# EAGLE design vreg (EAGLE 7.5.0)
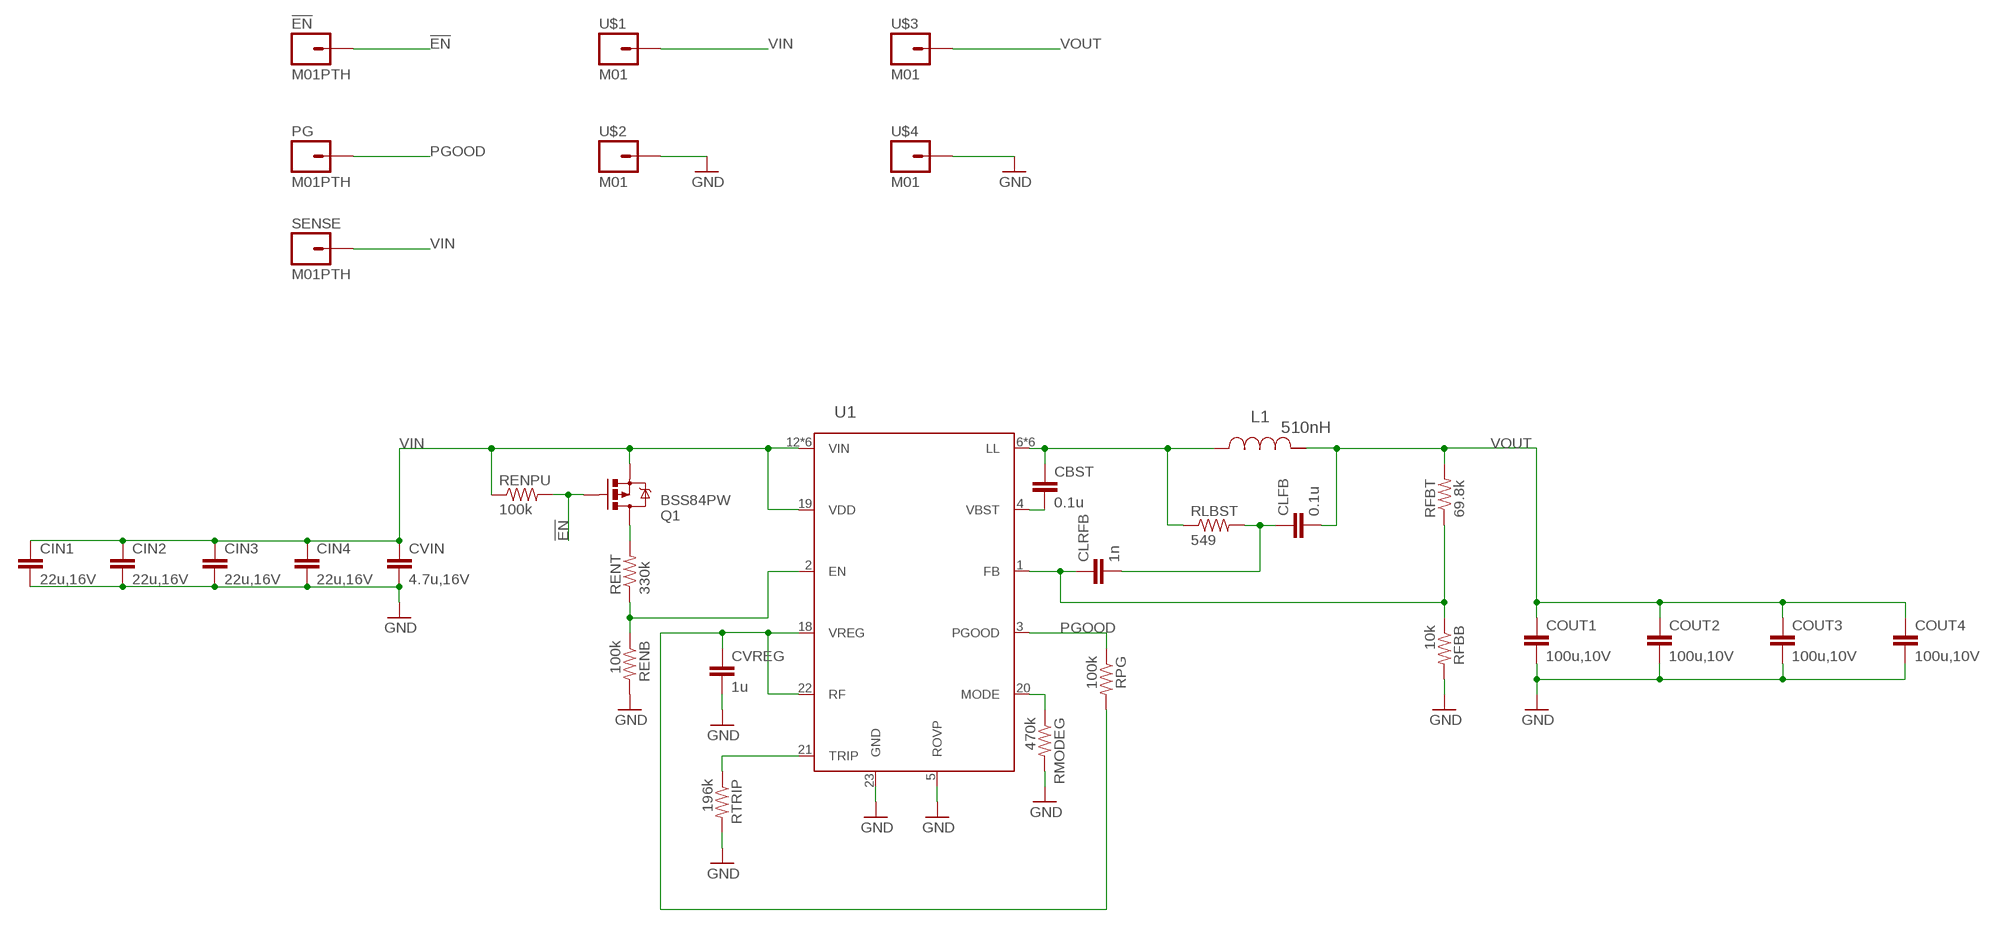
[diagram p0: schematic, sheet 1]

## Parts
!EN  M01PTH  [1X01]
CBST  0.1u  CAP0603-CAP  [0603-CAP]
CIN1  22u,16V  CAP1210  [1210]
CIN2  22u,16V  CAP1210  [1210]
CIN3  22u,16V  CAP1210  [1210]
CIN4  22u,16V  CAP1210  [1210]
CLFB  0.1u  CAP0603-CAP  [0603-CAP]
CLRFB  1n  CAP0603-CAP  [0603-CAP]
COUT1  100u,10V  CAP1210  [1210]
COUT2  100u,10V  CAP1210  [1210]
COUT3  100u,10V  CAP1210  [1210]
COUT4  100u,10V  CAP1210  [1210]
CVIN  4.7u,16V  CAP1206  [1206]
CVREG  1u  CAP0603-CAP  [0603-CAP]
L1  510nH  FP1107R1-R51-R  [FP1107]
PG  M01PTH  [1X01]
Q1  BSS84PW  [SOT323]
RENB  100k  RESISTOR0603  [0603-RES]
RENPU  100k  RESISTOR0603  [0603-RES]
RENT  330k  RESISTOR0603  [0603-RES]
RFBB  10k  RESISTOR0603  [0603-RES]
RFBT  69.8k  RESISTOR0603  [0603-RES]
RLBST  549  RESISTOR0603  [0603-RES]
RMODEG  470k  RESISTOR0603  [0603-RES]
RPG  100k  RESISTOR0603  [0603-RES]
RTRIP  196k  RESISTOR0603  [0603-RES]
SENSE  M01PTH  [1X01]
U1  TPS53319DQPR  [DQP0022A]
U$1  M01  [PIN_16AWG]
U$2  M01  [PIN_16AWG]
U$3  M01  [PIN_16AWG]
U$4  M01  [PIN_16AWG]

## Nets
!EN: !EN.1 Q1.1(G) RENPU.2
GND: CIN1.2 CIN2.2 CIN3.2 CIN4.2 COUT1.2 COUT2.2 COUT3.2 COUT4.2 CVIN.2 CVREG.2 RENB.2 RFBB.2 RMODEG.2 RTRIP.2 U1.5(ROVP) U1.23(GND) U$2.1 U$4.1
LL: CBST.1 L1.1 RLBST.1 U1.6(LL) U1.7(LL) U1.8(LL) U1.9(LL) U1.10(LL) U1.11(LL)
N$2: RMODEG.1 U1.20(MODE)
N$3: RENB.1 RENT.1 U1.2(EN)
N$4: Q1.3(D) RENT.2
N$5: CVREG.1 RPG.2 U1.18(VREG) U1.22(RF)
N$6: RTRIP.1 U1.21(TRIP)
N$9: CBST.2 U1.4(VBST)
N$12: CLFB.1 CLRFB.2 RLBST.2
N$13: CLRFB.1 RFBB.1 RFBT.1 U1.1(FB)
PGOOD: PG.1 RPG.1 U1.3(PGOOD)
VIN: CIN1.1 CIN2.1 CIN3.1 CIN4.1 CVIN.1 Q1.2(S) RENPU.1 SENSE.1 U1.12(VIN) U1.13(VIN) U1.14(VIN) U1.15(VIN) U1.16(VIN) U1.17(VIN) U1.19(VDD) U$1.1
VOUT: CLFB.2 COUT1.1 COUT2.1 COUT3.1 COUT4.1 L1.2 RFBT.2 U$3.1

## Library data of the parts
!EN PG SENSE = SparkFun-Connectors:M01: Header 1 Standard 1-pin 0.1" header. Use with straight break away headers (SKU : PRT-00116), right angle break away headers (PRT-00553), swiss pins (PRT-00743), machine pins (PRT-00117), and female headers (PRT-00115).
CBST CIN1-CIN4 CLFB CLRFB COUT1-COUT4 CVIN CVREG = SparkFun-Capacitors:CAP: Capacitor Standard 0603 ceramic capacitor, and 0.1" leaded capacitor.
L1 = parts:FP1107R1-R51-R; DCR: 2.9E-4; IDC: 18.0; L: 0.0; MANUFACTURER_NAME: Coiltronics; MANUFACTURER_PART_NUMBER: FP1107R1-R51-R; VENDOR: Coiltronics
Q1 = parts:BSS84PW: P-Channel FET
RENB RENPU RENT RFBB RFBT RLBST RMODEG RPG RTRIP = SparkFun-Resistors:RESISTOR: Resistor Basic schematic elements and footprints for 0603, 1206, and PTH resistors.
U1 = parts:TPS53319DQPR; DATASHEETURL: http://www.ti.com/product/tps53318; FREQUENCY: 500000.0; IMAX: 8.0; MANUFACTURER_NAME: Texas Instruments; MANUFACTURER_PART_NUMBER: TPS53318DQPR; MKTG_PACKAGE: DQP0022A; NSID: TPS53318DQPR; PACKAGE: DQP0022A; VENDOR: Texas Instruments
U$1-U$4 = parts:M01

## Board
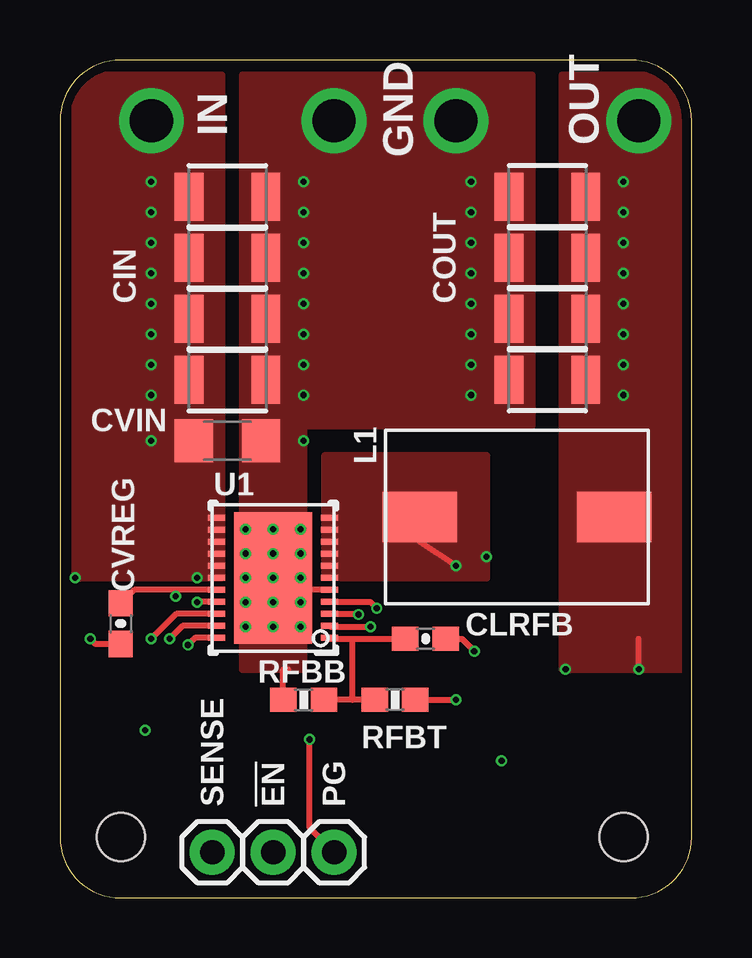
[diagram p1: board, top side]
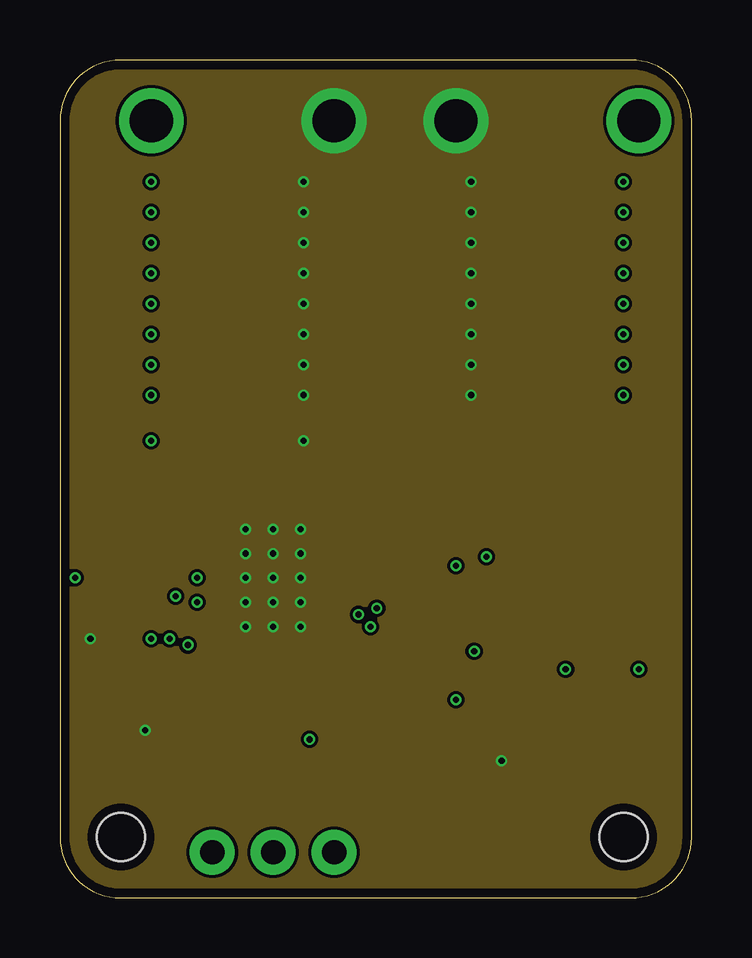
[diagram p2: board, inner layer Route2]
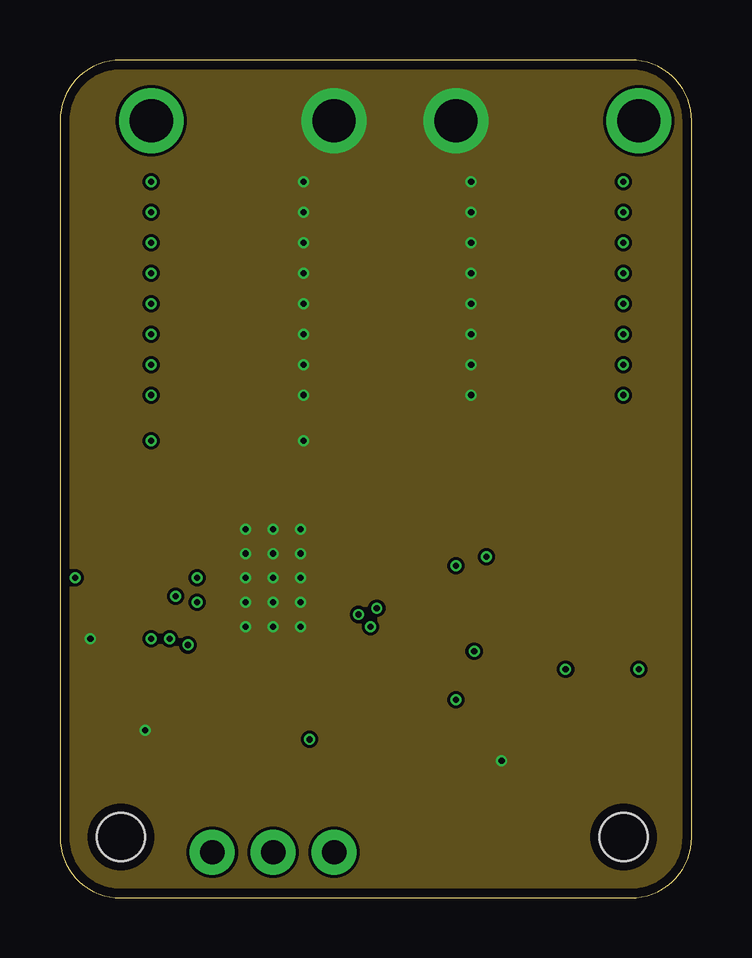
[diagram p3: board, inner layer Route15]
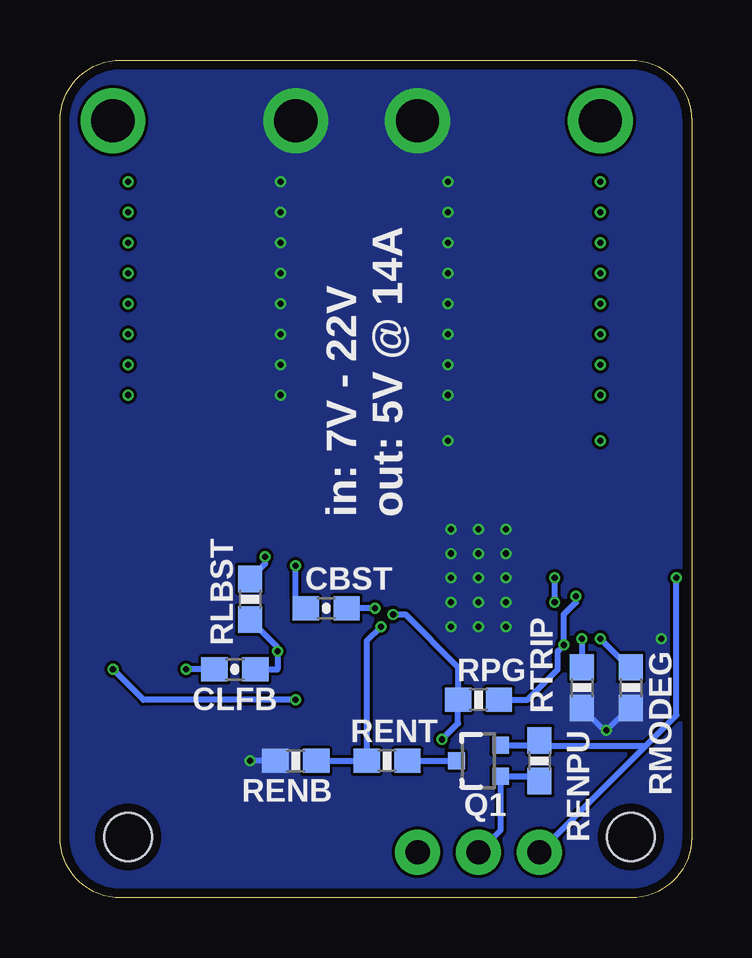
[diagram p4: board, bottom side, seen from below]

Size 26.34 x 34.91 mm. Coordinates in mm from the lower left corner, seen from the top.
Outline: 0,32.38 0,2.54 arc90 2.54,0 23.8,0 arc90 26.34,2.54 26.34,32.38 arc90 23.8,34.91 2.54,34.91 arc90 0,32.38
Copper layers (1*2*15*16): Top 0.035559375mm / dielectric 0.17018125mm / Route2 0.01778125mm / dielectric 47mil / Route15 0.01778125mm / dielectric 0.17018125mm / Bottom 0.035559375mm
Design rules "OSHPark-4layer": minimum track width 5mil, minimum drill 10mil, track to track 5mil, track to pad 5mil, pad to pad 5mil, via to via 5mil, smd to smd 5mil, copper to edge 15mil, drill to drill 6mil, minimum pad ring 4mil, minimum via ring 4mil, stop-mask expansion 2.5mil, vias tented up to drill 0mil, thermal gap 10mil
Holes 2 mm at 2.54,2.54 23.5,2.54

### Footprints (pad centres in the part's own frame; a part is rotated, then mirrored left to right if it is on the bottom)
1X01 = drill 1.016 pad 1.88: 1 0,0
0603-CAP = smd 1.1 x 1: 1 -0.85,0; 2 0.85,0
1210 = smd 1.2 x 2: 1 -1.6,0; 2 1.6,0
1206 = smd 1.6 x 1.8: 1 -1.4,0; 2 1.4,0
FP1107 = smd 3.099 x 2.108: 1 -4.051,0; 2 4.051,0
SOT323 = smd 0.7 x 0.7: 1 -0.65,-0.925; 2 0.65,-0.925; 3 0,0.925
0603-RES = smd 1.1 x 1: 1 -0.85,0; 2 0.85,0
DQP0022A = smd 0.711 x 0.254: 1 -2.35,2.5; 2 -2.35,2; 3 -2.35,1.5; 4 -2.35,1; 5 -2.35,0.5; 6 -2.35,0; 7 -2.35,-0.5; 8 -2.35,-1; 9 -2.35,-1.5; 10 -2.35,-2; 11 -2.35,-2.5; 12 2.35,-2.5; 13 2.35,-2; 14 2.35,-1.5; 15 2.35,-1; 16 2.35,-0.5; 17 2.35,0; 18 2.35,0.5; 19 2.35,1; 20 2.35,1.5; 21 2.35,2; 22 2.35,2.5 | smd 3.251 x 5.486: 23 0,0
PIN_16AWG = drill 1.8: 1 0,0

### Placement (x,y rotation side)
!EN  8.89,1.91 0 top
CBST  15.24,12.06 0 bottom
CIN1  6.99,29.21 0 top
CIN2  6.99,26.67 0 top
CIN3  6.99,24.13 0 top
CIN4  6.99,21.59 0 top
CLFB  19.05,9.53 180 bottom
CLRFB  15.24,10.79 0 top
COUT1  20.32,29.21 180 top
COUT2  20.32,26.67 180 top
COUT3  20.32,24.13 180 top
COUT4  20.32,21.59 180 top
CVIN  6.99,19.05 0 top
CVREG  2.54,11.43 270 top
L1  19.05,15.88 0 top
PG  11.43,1.91 0 top
Q1  8.89,5.71 90 bottom
RENB  16.51,5.71 180 bottom
RENPU  6.35,5.71 270 bottom
RENT  12.7,5.71 0 bottom
RFBB  10.16,8.26 180 top
RFBT  13.97,8.26 0 top
RLBST  18.41,12.45 270 bottom
RMODEG  2.54,8.76 270 bottom
RPG  8.89,8.26 0 bottom
RTRIP  4.57,8.76 270 bottom
SENSE  6.35,1.91 0 top
U1  8.89,13.34 180 top
U$1  3.81,32.39 0 top
U$2  16.51,32.39 0 top
U$3  24.13,32.39 0 top
U$4  11.43,32.39 0 top

### Tracks (layer width: path | path; a pad name or v marks a point on that pad's centre or on a via)
!EN
  Bottom 0.254: RENPU.2 6.55,5.07 Q1.1 7.96,2.83 !EN.1
GND  (via drill 0.25)
  Top 0.254: U1.5 9.39,12.84 U1.23 | RFBB.2 9.31,9.53 9.53,9.53 | CVREG.2 1.48,10.58 v1.27,10.79
  Bottom 0.254: RENB.2 v18.41,5.71 | RMODEG.2 2.63,7.91 v3.56,6.99 3.64,6.99 RTRIP.2
  other vias: 7.75,15.37 8.89,15.37 10.03,15.37 7.75,14.35 8.89,14.35 10.03,14.35 7.75,13.34 8.89,13.34 10.03,13.34 7.75,12.32 8.89,12.32 10.03,12.32 7.75,11.3 8.89,11.3 10.03,11.3 10.16,29.84 10.16,28.57 10.16,27.3 10.16,26.04 10.16,24.76 10.16,23.49 10.16,22.22 10.16,20.95 10.16,19.05 17.14,29.84 17.14,28.57 17.14,27.3 17.14,26.04 17.14,24.76 17.14,23.49 17.14,22.22 17.14,20.95
  pour Top (isolate 0.406, rank 3, no thermals): 7.62,9.53 10.16,9.53 10.16,19.68 19.68,19.68 19.68,34.29 7.62,34.29
  pour Route2: -1.27,37.47 29.21,37.47 29.21,-0.64 -1.27,-0.64
  pour Route15: -1.27,37.47 29.21,37.47 29.21,-0.64 -1.27,-0.64
  pour Bottom (no thermals): 0,34.93 26.42,34.93 26.42,0 0,0
LL  (via drill 0.25)
  Top 0.254: v16.51,13.84 15,14.85 L1.1
  Bottom 0.254: CBST.1 16.51,12.48 v16.51,13.84 | RLBST.1 17.78,13.93 v17.78,14.22
  pour Top (isolate 0.254, rank 2, no thermals): 17.78,18.41 11.05,18.41 11.05,13.34 17.78,13.34
N$2  (via drill 0.25)
  Top 0.254: U1.20 4.85,11.84 v3.81,10.79
  Bottom 0.254: v3.81,10.79 2.54,9.53 RMODEG.1
N$3  (via drill 0.25)
  Top 0.254: U1.2 11.27,11.3 v12.95,11.3
  Bottom 0.254: RENB.1 RENT.1 13.55,10.71 v12.95,11.3
N$4
  Bottom 0.254: RENT.2 Q1.3
N$5  (via drill 0.25)
  Top 0.254: U1.18 4.83,12.84 | 4.83,12.84 3.1,12.84 CVREG.1 | U1.22 5.63,10.84 v5.33,10.54 | v4.83,12.57 4.83,12.84
  Bottom 0.254: RPG.2 6.86,8.26 5.59,9.53 5.59,10.29 v5.33,10.54 5.33,11.81 4.83,12.32 v4.83,12.57
N$6  (via drill 0.25)
  Top 0.254: U1.21 5.11,11.34 v4.57,10.79
  Bottom 0.254: v4.57,10.79 RTRIP.1
N$9  (via drill 0.25)
  Top 0.254: U1.4 12.94,12.34 v13.21,12.06
  Bottom 0.254: v13.21,12.06 CBST.2
N$12  (via drill 0.25)
  Top 0.254: CLRFB.2 16.76,10.79 v17.27,10.29
  Bottom 0.254: CLFB.1 17.27,9.53 v17.27,10.29 17.27,10.45 RLBST.2
N$13
  Top 0.254: U1.1 11.28,10.79 12.19,10.79 | 12.19,10.79 CLRFB.1 | RFBT.1 12.19,8.26 | 12.19,8.26 RFBB.1 | 12.19,8.26 12.19,10.79
PGOOD  (via drill 0.25)
  Top 0.254: U1.3 12.42,11.84 v12.45,11.81 | PG.1 10.41,2.92 v10.41,6.6
  Bottom 0.254: 9.74,8.6 RPG.1 | v12.45,11.81 11.94,11.81 9.74,9.61 RPG.1 | v10.41,6.6 9.74,7.28 RPG.1
VIN  (via drill 0.25)
  Top 0.254: U1.19 5.86,12.34 v5.71,12.32
  Bottom 0.254: v5.71,12.32 v5.71,13.34 | Q1.2 6.55,6.37 RENPU.1 6.13,6.35 1.9,6.35 | SENSE.1 1.9,6.35 | 1.9,6.35 0.64,7.62 v0.64,13.34
  other vias: 3.81,29.84 3.81,28.57 3.81,27.3 3.81,26.04 3.81,24.76 3.81,23.49 3.81,22.22 3.81,20.95 3.81,19.05
  pour Top (no thermals): 6.73,13.34 0.64,13.34 0.64,34.29 6.73,34.29
VOUT  (via drill 0.25)
  Top 0.254: RFBT.2 v16.51,8.26 | v24.13,9.53 24.13,10.79
  Bottom 0.254: v16.51,8.26 22.86,8.26 v24.13,9.53 | CLFB.2 v21.08,9.53
  other vias: 23.5,29.84 23.5,28.57 23.5,27.3 23.5,26.04 23.5,24.76 23.5,23.49 23.5,22.22 23.5,20.95
  pour Top (isolate 0.406, rank 2, no thermals): 20.96,34.29 20.96,9.53 26.04,9.53 26.04,34.29

### Text on the board
tNames: IN | OUT | GND | CIN | COUT
bNames: in: 7V - 22V / out: 5V @ 14A